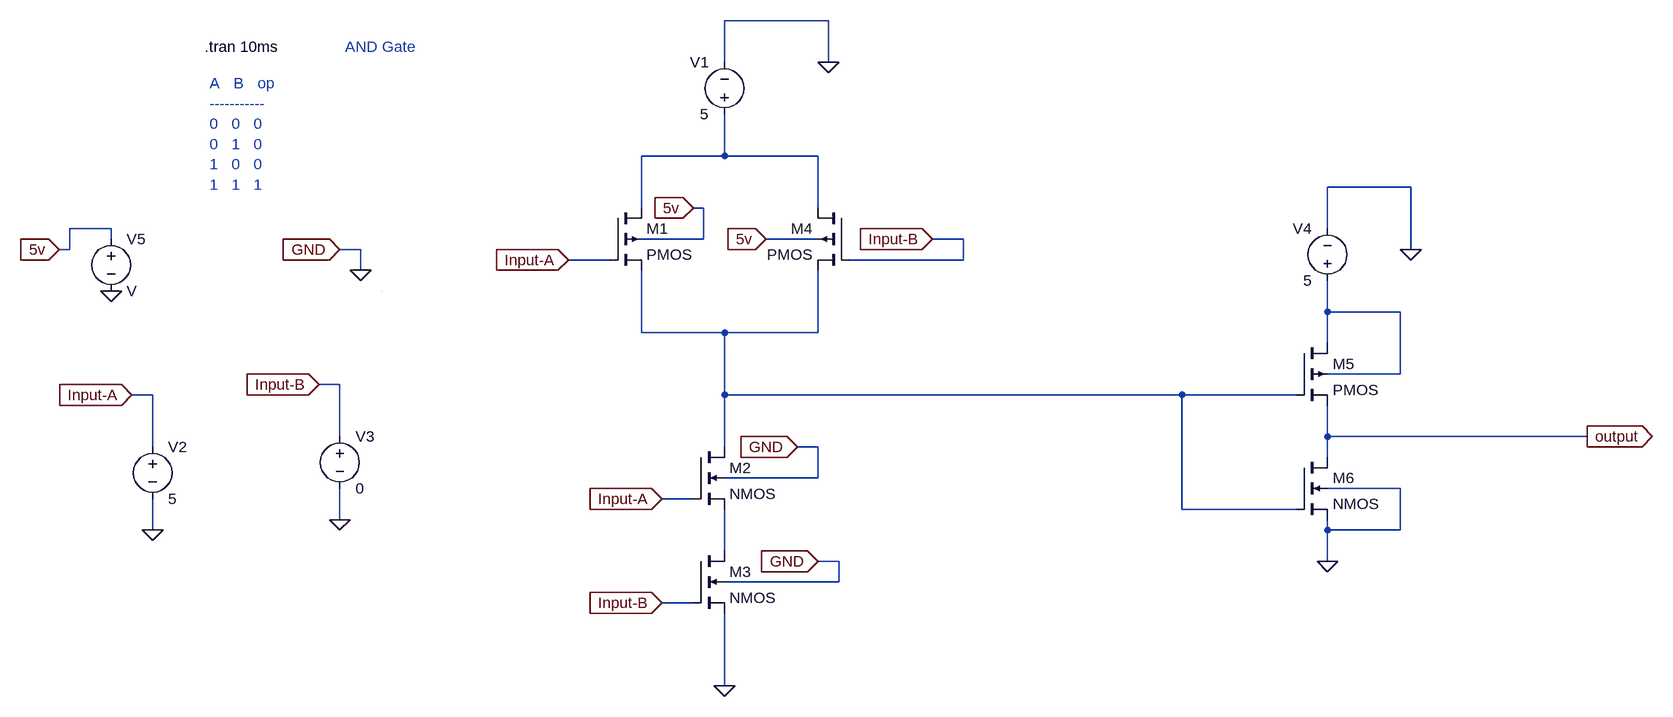
[diagram p0: schematic 4_AND_gate.asc]
4_AND_gate.asc, the LTspice schematic file:
Version 4.1
SHEET 1 1992 680
WIRE 688 -416 528 -416
WIRE 528 -352 528 -416
WIRE 688 -352 688 -416
WIRE 528 -208 528 -272
WIRE 528 -208 400 -208
WIRE 672 -208 528 -208
WIRE 1584 -160 1456 -160
WIRE 400 -128 400 -208
WIRE 496 -128 480 -128
WIRE 672 -128 672 -208
WIRE -416 -96 -480 -96
WIRE 1456 -96 1456 -160
WIRE -416 -80 -416 -96
WIRE 496 -80 496 -128
WIRE 496 -80 400 -80
WIRE 672 -80 592 -80
WIRE 896 -80 848 -80
WIRE -480 -64 -480 -96
WIRE -480 -64 -496 -64
WIRE -32 -64 -64 -64
WIRE 1584 -64 1584 -160
WIRE 352 -48 288 -48
WIRE 896 -48 896 -80
WIRE 896 -48 720 -48
WIRE -32 -32 -32 -64
WIRE 1456 32 1456 -16
WIRE 1568 32 1456 32
WIRE 400 64 400 -32
WIRE 528 64 400 64
WIRE 672 64 672 -32
WIRE 672 64 528 64
WIRE 1456 80 1456 32
WIRE 1568 128 1568 32
WIRE 1568 128 1456 128
WIRE -64 144 -96 144
WIRE -352 160 -384 160
WIRE 528 160 528 64
WIRE 1232 160 528 160
WIRE 1408 160 1232 160
WIRE -64 224 -64 144
WIRE 1456 224 1456 176
WIRE 1856 224 1456 224
WIRE -352 240 -352 160
WIRE 528 240 528 160
WIRE 672 240 640 240
WIRE 1456 256 1456 224
WIRE 672 288 672 240
WIRE 672 288 528 288
WIRE 1568 304 1456 304
WIRE 480 320 432 320
WIRE 1232 336 1232 160
WIRE 1408 336 1232 336
WIRE -64 352 -64 304
WIRE -352 368 -352 320
WIRE 1456 368 1456 352
WIRE 1568 368 1568 304
WIRE 1568 368 1456 368
WIRE 528 400 528 336
WIRE 704 416 672 416
WIRE 1456 416 1456 368
WIRE 704 448 704 416
WIRE 704 448 528 448
WIRE 480 480 432 480
WIRE 528 608 528 496
WIRE 0 0 0 0
FLAG 688 -352 0
FLAG 528 608 0
FLAG 288 -48 Input-A
IOPIN 288 -48 In
FLAG 432 320 Input-A
IOPIN 432 320 In
FLAG 432 480 Input-B
IOPIN 432 480 In
FLAG 848 -80 Input-B
IOPIN 848 -80 In
FLAG -352 368 0
FLAG -384 160 Input-A
IOPIN -384 160 In
FLAG -64 352 0
FLAG -96 144 Input-B
IOPIN -96 144 In
FLAG 1456 416 0
FLAG 1584 -64 0
FLAG 1856 224 output
IOPIN 1856 224 Out
FLAG -64 -64 GND
IOPIN -64 -64 In
FLAG -32 -32 0
FLAG -416 0 0
FLAG -496 -64 5v
IOPIN -496 -64 In
FLAG 592 -80 5v
IOPIN 592 -80 In
FLAG 480 -128 5v
IOPIN 480 -128 In
FLAG 672 416 GND
IOPIN 672 416 In
FLAG 640 240 GND
IOPIN 640 240 In
SYMBOL pmos4 352 -128 R0
SYMATTR InstName M1
SYMBOL nmos4 480 240 R0
SYMATTR InstName M2
SYMBOL nmos4 480 400 R0
SYMATTR InstName M3
SYMBOL pmos4 720 -128 M0
SYMATTR InstName M4
SYMBOL voltage 528 -256 R180
WINDOW 0 24 96 Left 2
WINDOW 3 24 16 Left 2
WINDOW 123 0 0 Left 0
WINDOW 39 0 0 Left 0
SYMATTR InstName V1
SYMATTR Value 5
SYMBOL voltage -352 224 R0
WINDOW 123 0 0 Left 0
WINDOW 39 0 0 Left 0
SYMATTR InstName V2
SYMATTR Value 5
SYMBOL voltage -64 208 R0
WINDOW 123 0 0 Left 0
WINDOW 39 0 0 Left 0
SYMATTR InstName V3
SYMATTR Value 0
SYMBOL pmos4 1408 80 R0
SYMATTR InstName M5
SYMBOL nmos4 1408 256 R0
SYMATTR InstName M6
SYMBOL voltage 1456 0 R180
WINDOW 0 24 96 Left 2
WINDOW 3 24 16 Left 2
WINDOW 123 0 0 Left 0
WINDOW 39 0 0 Left 0
SYMATTR InstName V4
SYMATTR Value 5
SYMBOL voltage -416 -96 R0
SYMATTR InstName V5
TEXT -272 -376 Left 2 !.tran 10ms
TEXT -56 -376 Left 2 ;AND Gate
TEXT -264 -320 Left 2 ;A   B   op\n-----------\n0   0   0\n0   1   0\n1   0   0\n1   1   1

The netlist it stands for:
* 4_AND_gate.asc
M1 N001 Input-A N003 5v PMOS
M2 N003 Input-A N004 0 NMOS
M3 N004 Input-B 0 0 NMOS
M4 N001 Input-B N003 5v PMOS
V1 N001 0 5
V2 Input-A 0 5
V3 Input-B 0 0
M5 N002 N003 output N002 PMOS
M6 output N003 0 0 NMOS
V4 N002 0 5
V5 5v 0 V
.model NMOS NMOS
.model PMOS PMOS
.lib standard.mos
.tran 10ms
* AND Gate
* A   B   op
* -----------
* 0   0   0
* 0   1   0
* 1   0   0
* 1   1   1
.backanno
.end